# Altium schematic sheet EasyPHI_Core.SchDoc (part 3 of 3)
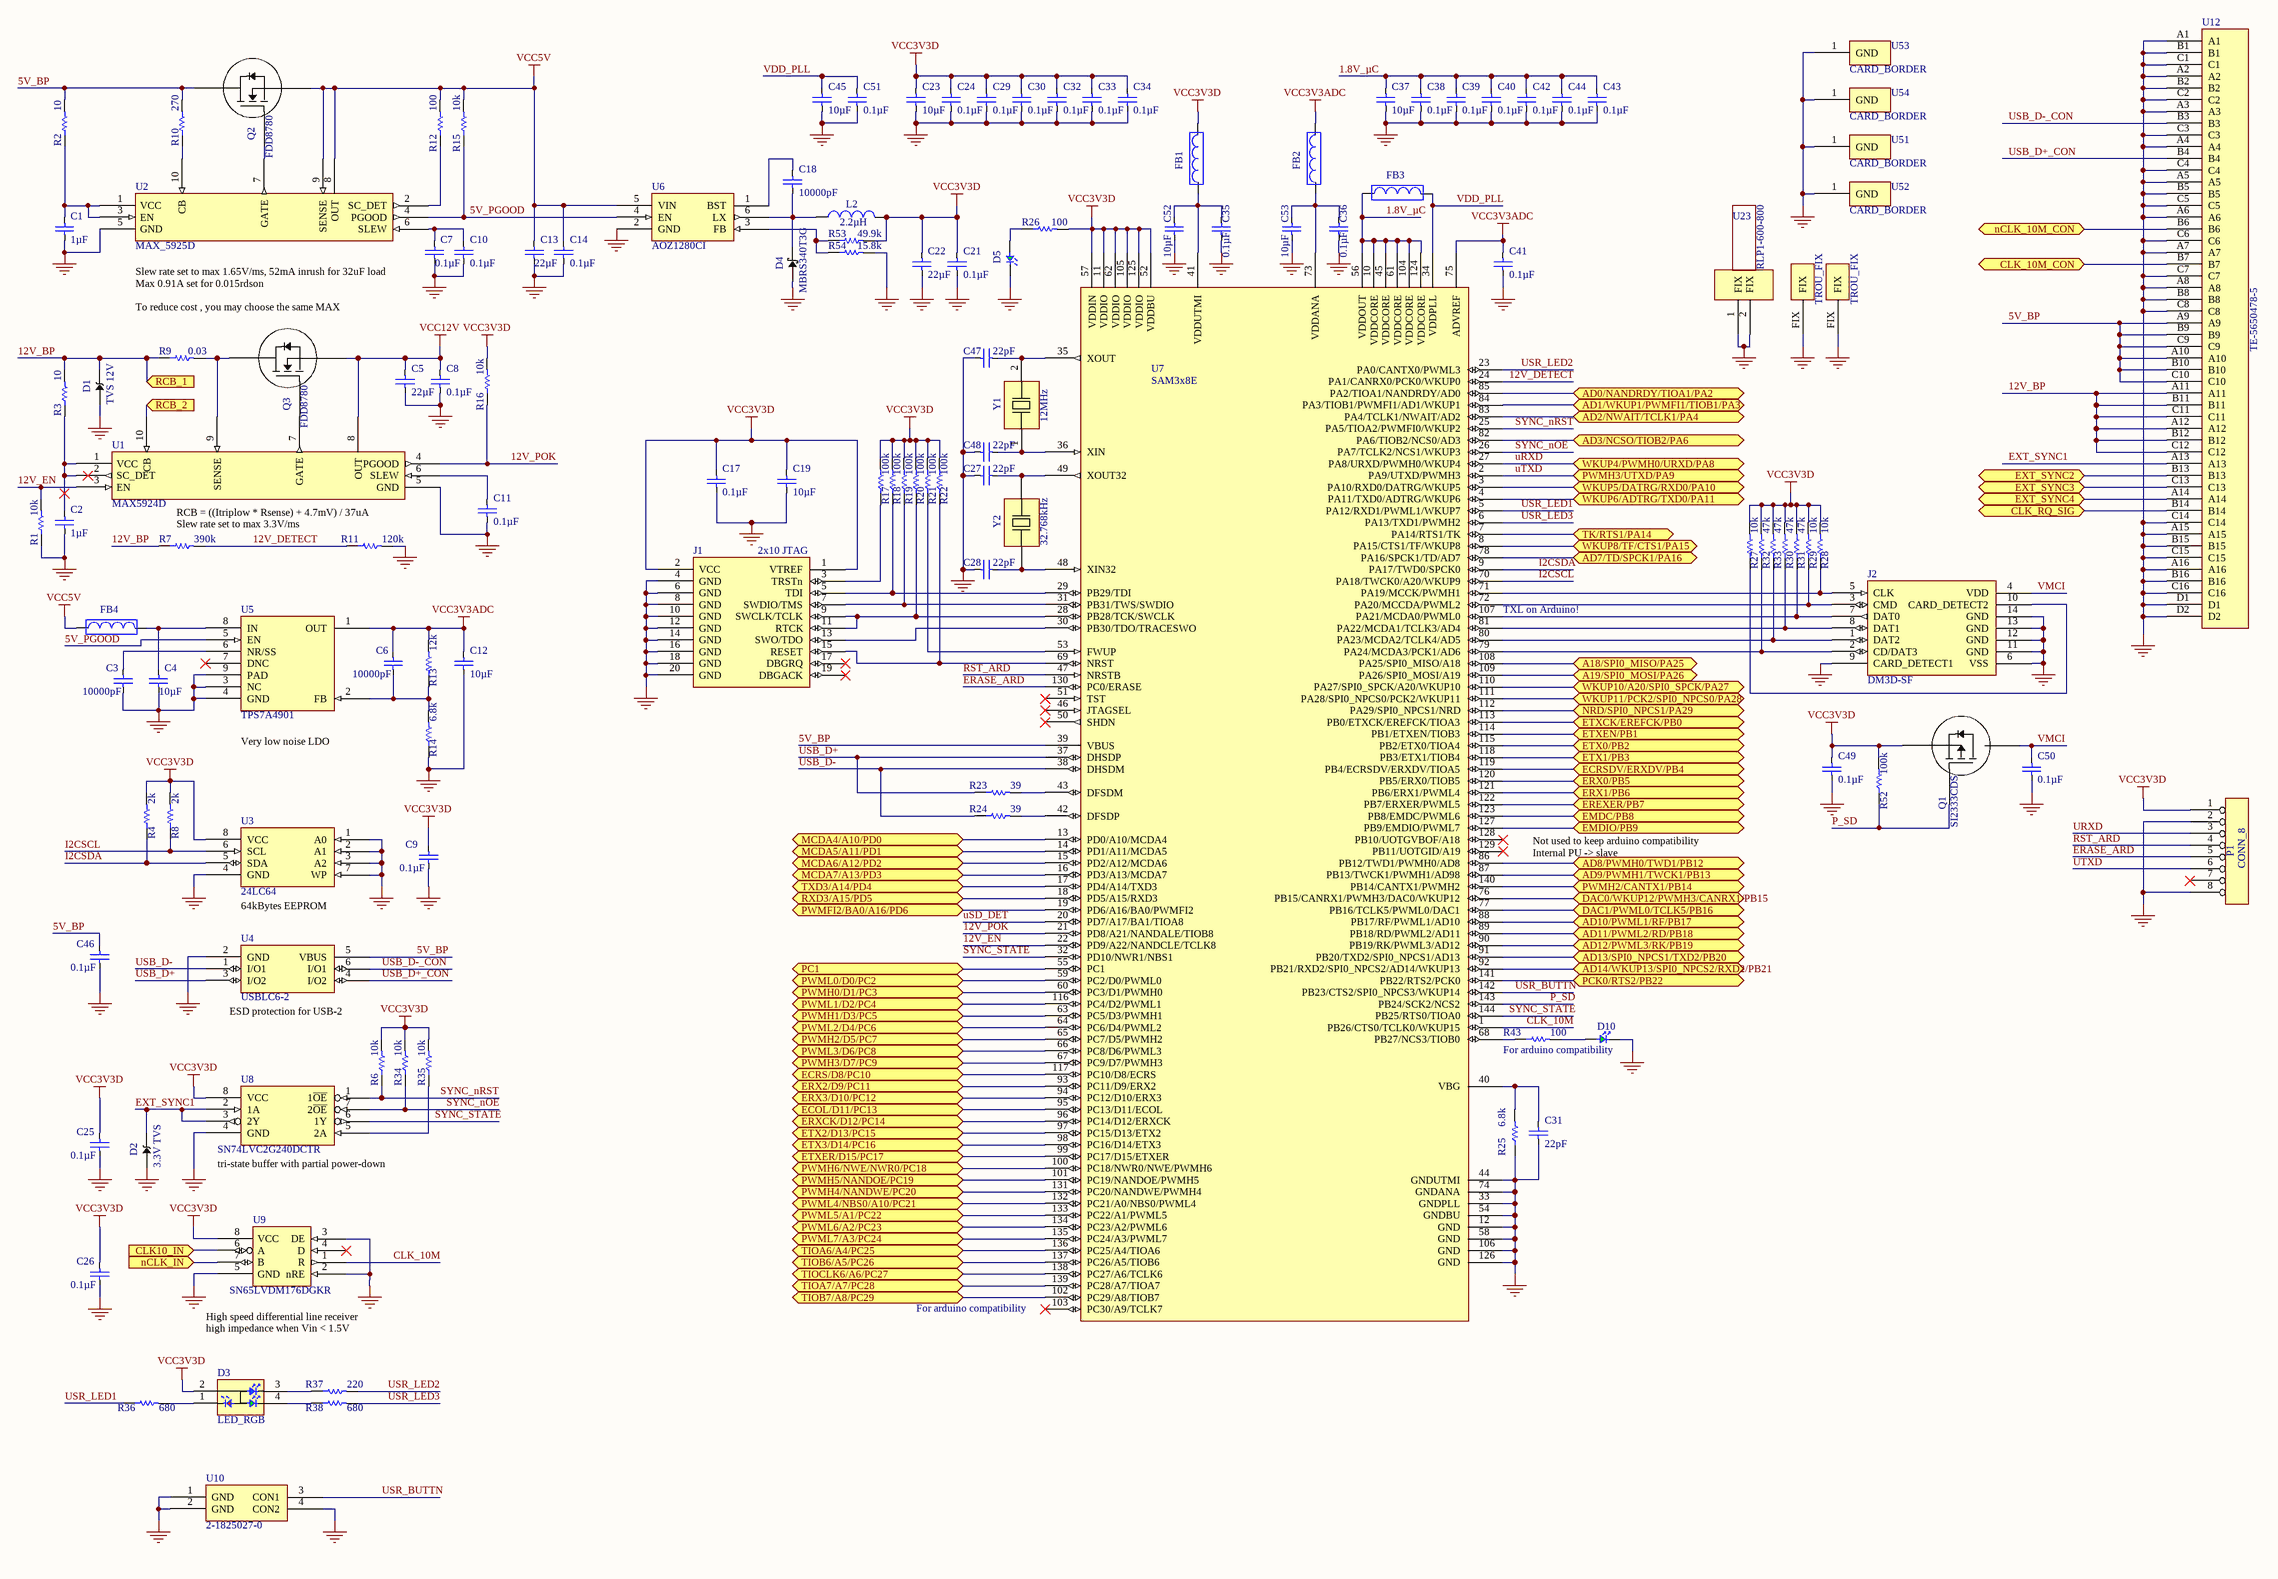
[diagram p2: EasyPHI_Core.SchDoc]

## Library data of the parts (continued)
Y2 = ABS25-32.768KHZ-T: CRYSTAL 32.7680KHZ 12.5PF SMD; Manufacturer: Abracon LLC; Frequency Tolerance: ±20ppm; ESR (Equivalent Series Resistance): 50 kOhm; Operating Mode: Fundamental; Design Item Id: ABS25-32.768KHZ-T; Supplier 1: Digi-Key; Supplier Part Number 1: 535-9166-1-ND; Manufacturer Part Number: ABS25-32.768KHZ-T; RoHS: RoHS Compliant; Category: Crystals and Oscillators; Stock 1: 847492; Pricing 1: 1=0.38, 10=0.316, 50=0.2832, 100=0.252, 500=0.24, 1000=0.2016 (USD); Packaging: Cut Tape (CT); Type: kHz Crystal (Tuning Fork); Operating Temperature: -40°C ~ 85°C; Mounting Type: Surface Mount; Package / Case: 4-SOJ, 5.50mm pitch; ComponentLink1URL: http://www.abracon.com/Resonators/abs25.pdf; ComponentLink1Description: http://www.abracon.com/Resonators/abs25.pdf; Frequency Stability: -; Load Capacitance: 12.5pF; Ratings: -; Size / Dimension: 0.315" L x 0.150" W (8.00mm x 3.80mm); Height: 0.098" (2.50mm)